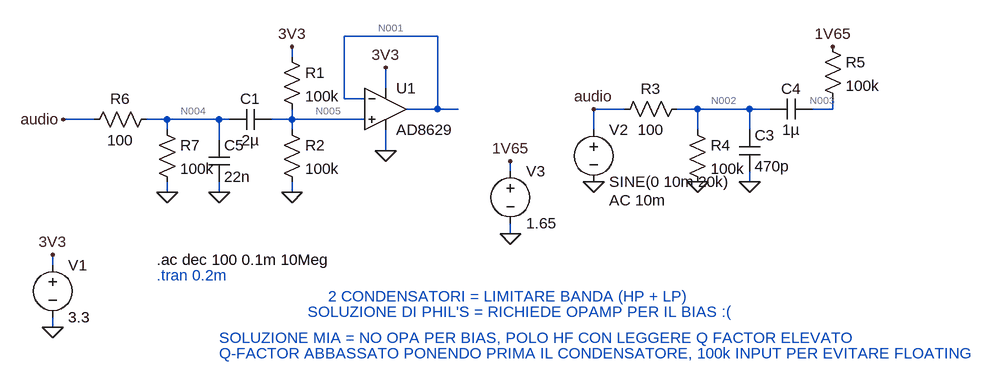
[diagram p0: schematic Analogue_IN.asc]
Analogue_IN.asc, the LTspice schematic file:
Version 4
SHEET 1 1108 680
WIRE 288 32 144 32
WIRE 64 64 64 48
WIRE 208 112 208 80
WIRE 144 128 144 32
WIRE 176 128 144 128
WIRE 288 144 288 32
WIRE 288 144 240 144
WIRE 320 144 288 144
WIRE 576 144 528 144
WIRE 688 144 656 144
WIRE 768 144 688 144
WIRE 800 144 768 144
WIRE 896 144 896 128
WIRE 896 144 864 144
WIRE -240 160 -288 160
WIRE -128 160 -160 160
WIRE -48 160 -128 160
WIRE -32 160 -48 160
WIRE 64 160 64 144
WIRE 64 160 32 160
WIRE 176 160 64 160
WIRE -128 176 -128 160
WIRE 64 176 64 160
WIRE 528 176 528 144
WIRE 688 176 688 144
WIRE 768 176 768 144
WIRE -48 192 -48 160
WIRE 208 208 208 176
WIRE 400 240 400 224
WIRE 768 256 768 240
WIRE -128 272 -128 256
WIRE -48 272 -48 256
WIRE 64 272 64 256
WIRE 400 336 400 320
WIRE -304 384 -304 368
WIRE -304 480 -304 464
FLAG 208 208 0
FLAG -304 480 0
FLAG 208 80 3V3
FLAG -304 368 3V3
FLAG 64 272 0
FLAG 64 48 3V3
FLAG 688 256 0
FLAG 768 256 0
FLAG 896 48 1V65
FLAG 528 256 0
FLAG 528 144 audio
FLAG -48 272 0
FLAG -288 160 audio
FLAG 400 336 0
FLAG 400 224 1V65
FLAG -128 272 0
SYMBOL OpAmps\\AD8629 208 80 R0
SYMATTR InstName U1
SYMBOL voltage -304 368 R0
WINDOW 123 0 0 Left 0
WINDOW 39 0 0 Left 0
SYMATTR InstName V1
SYMATTR Value 3.3
SYMBOL res 48 48 R0
SYMATTR InstName R1
SYMATTR Value 100k
SYMBOL res 48 160 R0
SYMATTR InstName R2
SYMATTR Value 100k
SYMBOL cap 32 144 R90
WINDOW 0 0 32 VBottom 2
WINDOW 3 32 32 VTop 2
SYMATTR InstName C1
SYMATTR Value 2µ
SYMBOL res 672 128 R90
WINDOW 0 0 56 VBottom 2
WINDOW 3 32 56 VTop 2
SYMATTR InstName R3
SYMATTR Value 100
SYMBOL res 672 160 R0
SYMATTR InstName R4
SYMATTR Value 100k
SYMBOL cap 752 176 R0
SYMATTR InstName C3
SYMATTR Value 470p
SYMBOL cap 864 128 R90
WINDOW 0 0 32 VBottom 2
WINDOW 3 32 32 VTop 2
SYMATTR InstName C4
SYMATTR Value 1µ
SYMBOL res 880 32 R0
SYMATTR InstName R5
SYMATTR Value 100k
SYMBOL voltage 528 160 R0
WINDOW 123 24 124 Left 2
WINDOW 39 0 0 Left 0
SYMATTR Value2 AC 10m
SYMATTR InstName V2
SYMATTR Value SINE(0 10m 20k)
SYMBOL cap -64 192 R0
SYMATTR InstName C5
SYMATTR Value 22n
SYMBOL voltage 400 224 R0
WINDOW 123 0 0 Left 0
WINDOW 39 0 0 Left 0
SYMATTR InstName V3
SYMATTR Value 1.65
SYMBOL res -144 144 R90
WINDOW 0 0 56 VBottom 2
WINDOW 3 32 56 VTop 2
SYMATTR InstName R6
SYMATTR Value 100
SYMBOL res -144 160 R0
SYMATTR InstName R7
SYMATTR Value 100k
TEXT -144 376 Left 2 !.ac dec 100 0.1m 10Meg
TEXT 120 432 Left 2 ;2 CONDENSATORI = LIMITARE BANDA (HP + LP)
TEXT 88 456 Left 2 ;SOLUZIONE DI PHIL'S = RICHIEDE OPAMP PER IL BIAS :(
TEXT -48 496 Left 2 ;SOLUZIONE MIA = NO OPA PER BIAS, POLO HF CON LEGGERE Q FACTOR ELEVATO
TEXT -144 400 Left 2 ;.tran 0.2m
TEXT -48 520 Left 2 ;Q-FACTOR ABBASSATO PONENDO PRIMA IL CONDENSATORE, 100k INPUT PER EVITARE FLOATING

The netlist it stands for:
* Analogue_IN.asc
XU1 N005 N001 3V3 0 N001 AD8629  ; pins In+ In- V+ V- OUT
V1 3V3 0 3.3
R1 3V3 N005 100k
R2 N005 0 100k
C1 N005 N004 2µ
R3 N002 audio 100
R4 N002 0 100k
C3 N002 0 470p
C4 N003 N002 1µ
R5 1V65 N003 100k
V2 audio 0 SINE(0 10m 20k) AC 10m
C5 N004 0 22n
V3 1V65 0 1.65
R6 N004 audio 100
R7 N004 0 100k
.ac dec 100 0.1m 10Meg
* 2 CONDENSATORI = LIMITARE BANDA (HP + LP)
* SOLUZIONE DI PHIL'S = RICHIEDE OPAMP PER IL BIAS :(
* SOLUZIONE MIA = NO OPA PER BIAS, POLO HF CON LEGGERE Q FACTOR ELEVATO
* .tran 0.2m
* Q-FACTOR ABBASSATO PONENDO PRIMA IL CONDENSATORE, 100k INPUT PER EVITARE FLOATING
.backanno
.end

* Results of the author's LTspice run, read from the files saved beside the schematic
* Operating Point, zero values left out:
*   V(n001) = 1.65 V
*   V(3v3) = 3.3 V
*   V(n005) = 1.65 V
*   V(n003) = 1.65 V
*   V(1v65) = 1.65 V
*   I(R2) = 16.5 µA
*   I(R1) = 16.5 µA
*   I(V1) = -667.3 µA
*   Ix(u1:1) = 25 pA
*   Ix(u1:2) = -25 pA
*   Ix(u1:99) = 650.8 µA
*   Ix(u1:50) = -650.8 µA
*   Ix(u1:45) = 25 pA
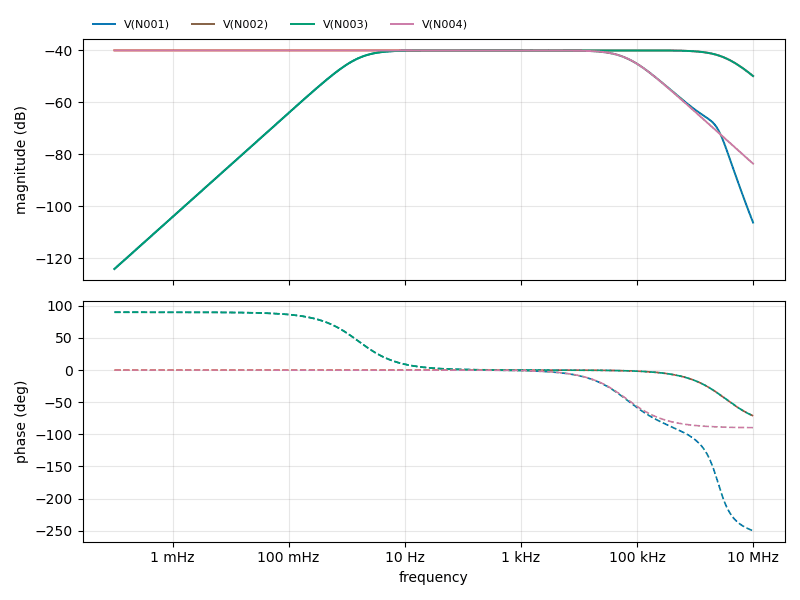
[diagram p1: AC Analysis of Analogue_IN.asc, plotted from the saved traces]
* AC Analysis, 1 run:
*   V(N001): -124.05 dB at 100 µHz, -106.22 dB at 10 MHz, peak -40.03 dB at 323.6 Hz, 3 dB below the peak at 1.588 Hz and 66.57 kHz
*   V(N002): -40.01 dB at 100 µHz, -49.88 dB at 10 MHz, peak -40.01 dB at 100 µHz, 3 dB below the peak at 3.386 MHz
*   V(N003): -124.05 dB at 100 µHz, -49.88 dB at 10 MHz, peak -40.02 dB at 2.344 kHz, 3 dB below the peak at 1.59 Hz and 3.393 MHz
*   V(N004): -40.01 dB at 100 µHz, -83.57 dB at 10 MHz, peak -40.01 dB at 100 µHz, 3 dB below the peak at 66.25 kHz